# EasyEDA Pro project TPS5454.eprj

# Schematic Schematic1
Create Date: 2024-06-30; Page Name: P1; Project Name: New Project_2024-06-30_17-42-01; Schematic Name: Schematic1; Update Date: 2024-06-30; Company: 嘉立创EDA; Page Size: A4; Version: V1.0
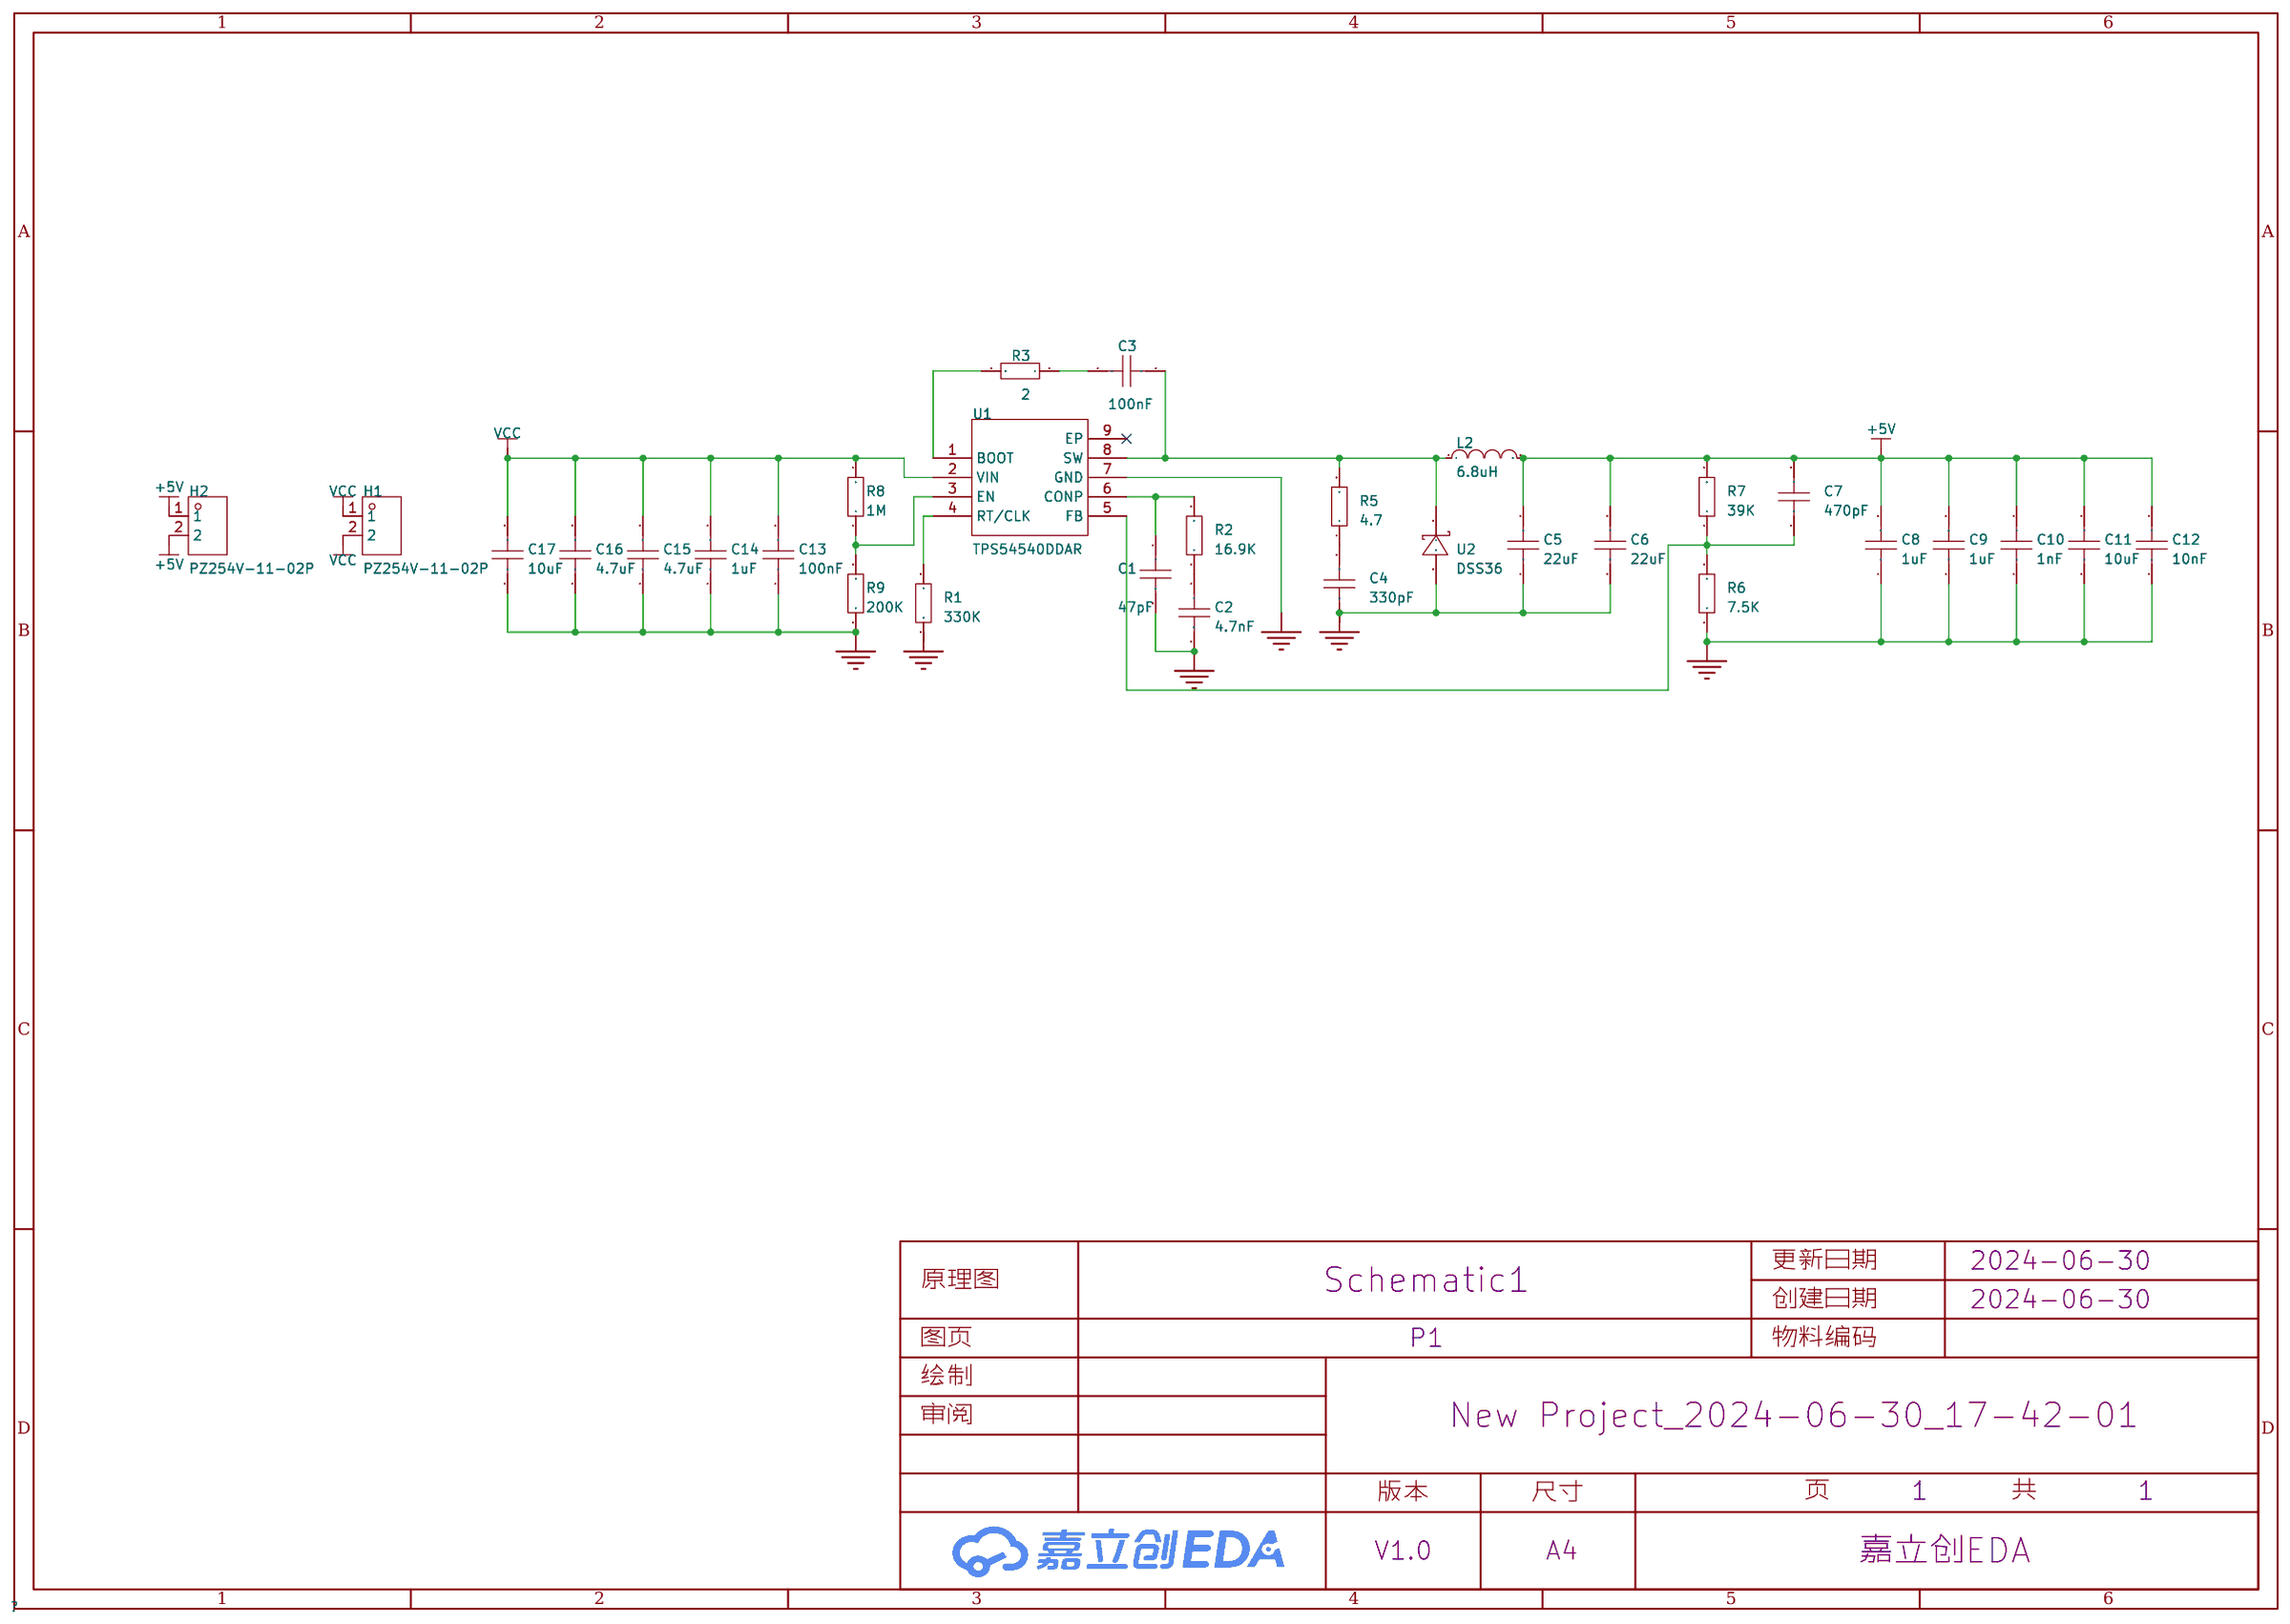
[diagram p0: schematic sheet]

## Parts
C1  47pF  [C0603]
C2  4.7nF  [C0603]
C3  100nF  [C0603]
C4  330pF  [C0603]
C5  22uF  [C0603]
C6  22uF  [C0603]
C7  470pF  [C0603]
C8  1uF  [C0603]
C9  1uF  [C0603]
C10  1nF  [C0603]
C11  10uF  [C0603]
C12  10nF  [C0603]
C13  100nF  [C0603]
C14  1uF  [C0603]
C15  4.7uF  [C0603]
C16  4.7uF  [C0603]
C17  10uF  [C0603]
H1  PZ254V-11-02P  [HDR-TH_2P-P2.54-V-M]
H2  PZ254V-11-02P  [HDR-TH_2P-P2.54-V-M]
L2  6.8uH  [IND-SMD_L7.0-W6.6]
R1  330K  [R0603]
R2  16.9K  [R0603]
R3  2  [R0603]
R5  4.7  [R0603]
R6  7.5K  [R0603]
R7  39K  [R0603]
R8  1M  [R0603]
R9  200K  [R0603]
U1  TPS54540DDAR  [SOIC-8_L4.9-W3.9-P1.27-LS6.0-BL-EP]
U2  DSS36  [SOD-123FL_L2.6-W1.6-LS3.6-RD]

## Library data of the parts
C1-C17 = CAP_0603: Supplier Footprint: 0603
H1 H2 = PZ254V-11-02P: 插针结构:1x2P;间距:2.54mm;行距:-;圆针/方针:方针;安装类型:直插;排数:单排;总PIN位数:2P;额定电流:-;额定电压:-;配合针长度:6mm;塑高:2.5mm;端接针长度:3mm;触头材质:黄铜;触头镀层:-;工作温度范围:-40℃~+105℃;颜色:黑色;; LCSC Part Name: 间距:2.54mm 1x2P 直插 方针; Supplier Part: C492401; Manufacturer: XFCN(兴飞); Supplier Footprint: 插件,P=2.54mm; JLCPCB Part Class: 扩展库; Datasheet: https://atta.szlcsc.com/upload/public/pdf/source/20200309/C492401_A812433581A9B211A7FFA413ADDFF0E5.pdf; Supplier: LCSC; Pin Structure: 1x2P; Pitch: 2.54mm; Circluar Pins/Square Pins: 方针; Mounting Type: 直插; Number of Rows: 单排; Number of Pins: 2P; Length of Mating Pin: 6mm; Insulation Height: 2.5mm; Length of End Connection Pin: 3mm; Contact Material: 黄铜; Operating Temperature Range: -40℃~+105℃; Color: 黑色
L2 = FXL0630-6R8-M: 电感值:6.8uH;精度:±20%;额定电流:5A;饱和电流(Isat):6A;类型:一体成型电感;; LCSC Part Name: 6.8uH ±20% 6A; Supplier Part: C167221; Manufacturer: cjiang(长江微电); Supplier Footprint: SMD,6.6x7mm; JLCPCB Part Class: 扩展库; Datasheet: https://atta.szlcsc.com/upload/public/pdf/source/20230516/3A080F5AF8C87BB81C3BA86E5F60E51A.pdf; Supplier: LCSC; Tolerance: ±20%; Rated Current: 5A; Saturation Current (Isat): 6A; DC Resistance (DCR): 48mΩ; Type: 一体成型电感
R1-R3 R5-R9 = Res_0603: Supplier Footprint: 0603
U1 = TPS54540DDAR: 功能类型:降压型;输出类型:可调;输入电压:4.5V~42V;输出电压:800mV~41.1V;输出电流(最大值):5A;; Supplier Part: C95286; Manufacturer: TI(德州仪器); Supplier Footprint: SOIC-8-EP; JLCPCB Part Class: 扩展库; Datasheet: https://www.ti.com/cn/lit/gpn/tps54540; Supplier: LCSC; Function: 降压型; Output Type: 可调; Input Voltage: 4.5V~42V; Output Voltage: 800mV~41.1V; Output Current (Max): 5A; Switching Frequency: 2.5MHz; Operating Temperature: -40℃~+150℃@(TJ); Synchronous Rectification: 否; Number of Outputs: 1; Topology: 降压式; Switch tube (built-in/external): 内置
U2 = DSS36: Supplier Part: C2923959; Manufacturer: CJ(江苏长电/长晶); Supplier Footprint: SOD-123FL; JLCPCB Part Class: 扩展库; Datasheet: https://atta.szlcsc.com/upload/public/pdf/source/20211215/0ADF0BE87438B9C1ECAEF7A20AC1E05E.pdf; Supplier: LCSC

## Nets
+5V: C5.2 C6.2 C7.2 C8.2 C9.2 C10.2 C11.2 C12.2 H2.1 H2.2 L2.2 R7.2
GND: C1.2 C2.2 C4.1 C5.1 C6.1 C8.1 C9.1 C10.1 C11.1 C12.1 C13.1 C14.1 C15.1 C16.1 C17.1 R1.1 R6.1 R9.1 U1.7(GND) U2.2(A)
VCC: C13.2 C14.2 C15.2 C16.2 C17.2 H1.1 H1.2 R8.2 U1.2(VIN)
$1N335: R1.2 U1.4(RT/CLK)
$1N525: C2.1 R2.1
$1N565: C1.1 R2.2 U1.6(CONP)
$1N644: C3.1 R3.1
$1N672: R3.2 U1.1(BOOT)
$1N803: C4.2 R5.1
$1N1007: C3.2 L2.1 R5.2 U1.8(SW) U2.1(K)
$1N1549: C7.1 R6.2 R7.1 U1.5(FB)
$1N2045: R8.1 R9.2 U1.3(EN)

Not connected (* = marked no-connect by the designer): U1 9(EP)*

# Board PCB1
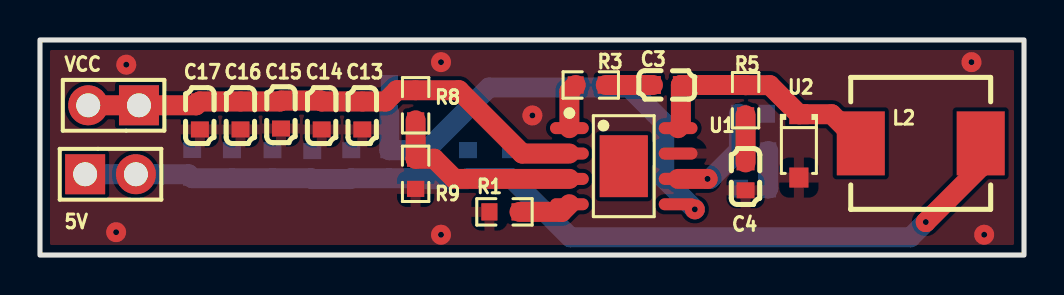
[diagram p1: board, top side]
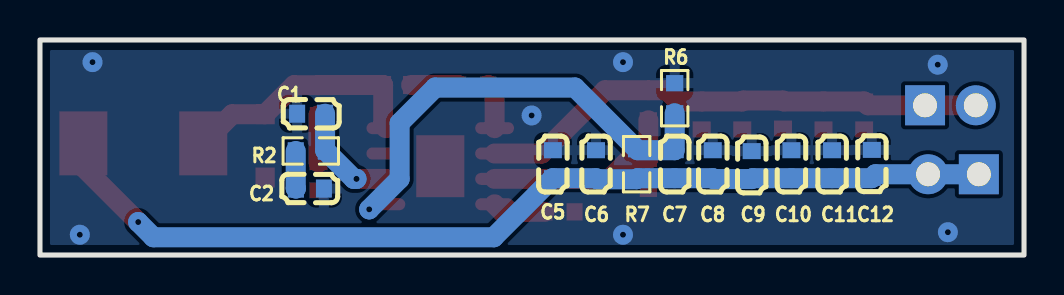
[diagram p2: board, bottom side, seen from below]

Outline 49.24 x 10.76 mm; copper layers: Top Layer, Bottom Layer. Coordinates in mm from the lower left corner of the outline.
Outline path: rectangle 0,10.76 49.24,0
Stack: Top Layer 0.035mm / Dielectric1 1.51mm FR4 er 4.5 / Bottom Layer 0.035mm

## Design rules (mm)
template: JLCPCB Capability(Two Layers Board)
spacing copperThickness1oz (default): track to track 0.102, other pairs 0.152 to 0.3
spacing copperThickness2oz: track to track 0.203, other pairs 0.152 to 0.3
track width copperThickness1oz (default): min 0.127, default 0.254, max 2.54
track width copperThickness2oz: min 0.203, default 0.254, max 2.54
differential pair differentialPair (default): width min 0.127, default 0.254, max 2.54; gap min 0.152, default 0.152
via viaSize (default): diameter min 0.5, default 0.61, max 10; hole min 0.3, default 0.305, max 6.3

## Placement (name value [footprint] x y rotation side)
5V  PZ254V-11-02P  [HDR-TH_2P-P2.54-V-M]  3.53 4.04 0 top
C1  47pF  [C0603]  35.67 7.07 0 bottom
C2  4.7nF  [C0603]  35.73 3.33 180 bottom
C3  100nF  [C0603]  31.37 8.51 0 top
C4  330pF  [C0603]  35.31 3.94 90 top
C5  22uF  [C0603]  23.58 4.55 270 bottom
C6  22uF  [C0603]  21.42 4.55 270 bottom
C7  470pF  [C0603]  17.48 4.55 270 bottom
C8  1uF  [C0603]  15.57 4.55 270 bottom
C9  1uF  [C0603]  13.63 4.5 270 bottom
C10  1nF  [C0603]  11.64 4.55 270 bottom
C11  10uF  [C0603]  9.61 4.55 270 bottom
C12  10nF  [C0603]  7.61 4.56 270 bottom
C13  100nF  [C0603]  16.13 6.98 90 top
C14  1uF  [C0603]  14.1 6.98 90 top
C15  4.7uF  [C0603]  12.06 7.03 90 top
C16  4.7uF  [C0603]  10.03 6.98 90 top
C17  10uF  [C0603]  8 6.98 90 top
L2  6.8uH  [IND-SMD_L7.0-W6.6]  44.07 5.59 0 top
R1  330K  [R0603]  23.24 2.16 0 top
R2  16.9K  [R0603]  35.69 5.21 180 bottom
R3  2  [R0603]  27.56 8.51 180 top
R5  4.7  [R0603]  35.31 7.75 90 top
R6  7.5K  [R0603]  17.48 7.85 270 bottom
R7  39K  [R0603]  19.38 4.55 270 bottom
R8  1M  [R0603]  18.8 7.49 90 top
R9  200K  [R0603]  18.8 4.06 90 top
U1  TPS54540DDAR  [SOIC-8_L4.9-W3.9-P1.27-LS6.0-BL-EP]  29.21 4.45 270 top
U2  DSS36  [SOD-123FL_L2.6-W1.6-LS3.6-RD]  37.97 5.46 270 top
VCC  PZ254V-11-02P  [HDR-TH_2P-P2.54-V-M]  3.68 7.49 180 top

## Footprints (pads in the part's own frame, mm; a bottom-side part is the same pattern mirrored in y, then rotated)
C0603
  rect 0.8x0.9 smd: 1(-0.7,0) 2(0.7,0)
HDR-TH_2P-P2.54-V-M
  rect 2x2 hole 1.2: 1(-1.27,0)
  round 2 hole 1.2: 2(1.27,0)
IND-SMD_L7.0-W6.6
  rect 2.4x3.2 smd: 1(-3,0) 2(3,0)
R0603
  rect 0.806x0.864 smd: 1(-0.753,0) 2(0.753,0)
SOD-123FL_L2.6-W1.6-LS3.6-RD
  rect 1x0.96 smd: 1(-1.585,0) 2(1.585,0)
SOIC-8_L4.9-W3.9-P1.27-LS6.0-BL-EP
  oval 0.602x1.941 smd: 1(-1.905,-2.72) 2(-0.635,-2.72) 3(0.635,-2.72) 4(1.905,-2.72) 5(1.905,2.72) 6(0.635,2.72) 7(-0.635,2.72) 8(-1.905,2.72)
  rect 3.098x2.41 smd: 9(0,0)

## Nets
As in the schematic, except:
+5V: 5V.1 5V.2 C5.2 C6.2 C7.2 C8.2 C9.2 C10.2 C11.2 C12.2 L2.2 R7.2
VCC: C13.2 C14.2 C15.2 C16.2 C17.2 R8.2 U1.2 VCC.1 VCC.2

Pads without a net: U1 9

## Via types
v1: diameter 1, hole 0.3, Top Layer to Bottom Layer, 9 vias
v2: diameter 1, hole 0.305, Top Layer to Bottom Layer, 1 via

## Routing (per net, layer and track width the routed paths; a pad name or vN(x,y) marks a point on that pad's centre or on a via; arc(x,y) is an arc through that point)
+5V: length 48.8
  Top Layer w1: v1(44.32,1.65) 47.07,4.4 L2.2
  Bottom Layer w1: v1(44.32,1.65) 43.56,0.89 26.53,0.89 C5.2 C6.2 21.36,3.79 R7.2 19.33,3.85 C7.2 C8.2 15.53,3.8 C9.2 13.58,3.85 C10.2 C11.2 7.63,3.85 C12.2 7.44,4.04 5V.2 5V.1
GND:
  vias: v1(3.81,1.14) v1(4.32,9.53) v1(20.07,9.65) v1(20.07,1.02) v1(24.64,6.98) v1(46.61,9.65) v1(47.24,1.02)
VCC: length 25.7
  Top Layer w1: 2.41,7.49 VCC.1 7.81,7.49 C17.2 C16.2 12.02,7.69 C15.2 14.05,7.73 C14.2 C13.2 17.3,7.69 17.86,8.25 R8.2 20.96,8.25 24.13,5.08 U1.2
$1N335: length 2.7
  Top Layer w1: R1.2 26.11,2.16 U1.4
$1N525: length 1.9
  Bottom Layer w1: 36.43,3.33 36.44,3.34 R2.1
$1N565: length 5.5
  Top Layer w1: U1.6 v2(33.4,3.81)
  Bottom Layer w1: v2(33.4,3.81) 33.54,3.81 R2.2 34.97,5.25 C1.1
$1N644: length 2.4
  Top Layer w1: R3.1 C3.1
$1N672: length 2.3
  Top Layer w1: R3.2 26.49,8.19 U1.1
$1N803: length 2.4
  Top Layer w1: C4.2 R5.1
$1N1007: length 12.4
  Top Layer w1: L2.1 39.61,7.05 U2.1 36.52,8.5 R5.2 35.3,8.51 C3.2 32.07,6.49 U1.8
$1N1549: length 22.6
  Bottom Layer w1: R6.2 C7.1 19.33,5.25 R7.1 22.47,8.38 29.46,8.38 31.24,6.6 31.24,3.81 v1(32.77,2.29)
$1N2045: length 10
  Top Layer w1: U1.3 20.74,3.81 19.73,4.82 R9.2 R8.1

## Copper pours and planes (outline as drawn; the poured copper is in the pictures)
GND on Top Layer: -2.03,12.57 50.29,12.57 50.29,-2.54 -2.03,-2.54
GND on Bottom Layer: -7.87,17.4 55.5,17.4 55.5,-9.14 -7.87,-9.14
